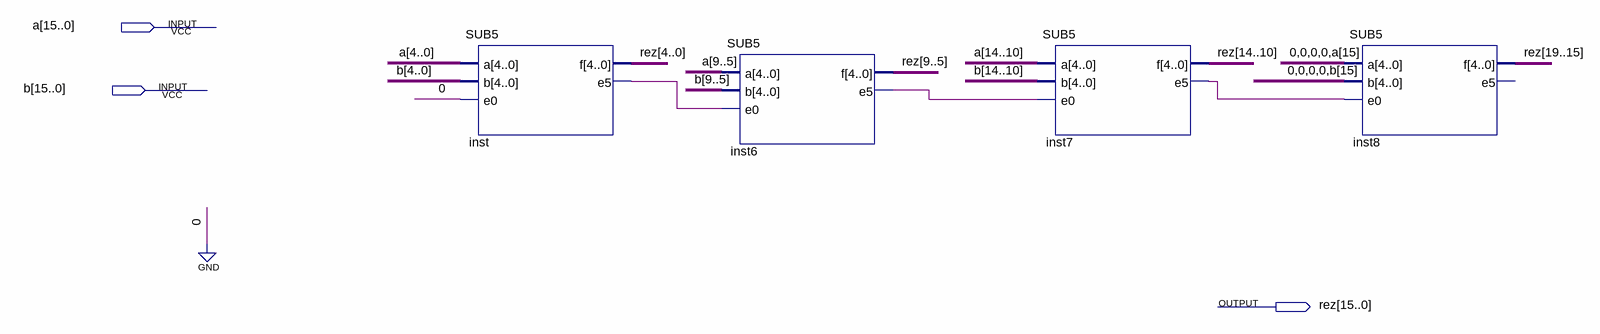
[diagram p0: schematic sheet]
// Quartus schematic sub.bdf as structural Verilog: 4 symbols, 3 pins
module sub (
  input  [15:0] a,
  input  [15:0] b,
  output [19:0] rez
);

  wire inst6_e5, inst7_e5, inst_e5;

  SUB5 inst (.a(a[4:0]), .b(b[4:0]), .e0(1'b0), .f(rez[4:0]), .e5(inst_e5));
  SUB5 inst6 (.a(a[9:5]), .b(b[9:5]), .e0(inst_e5), .f(rez[9:5]), .e5(inst6_e5));
  SUB5 inst7 (.a(a[14:10]), .b(b[14:10]), .e0(inst6_e5), .f(rez[14:10]), .e5(inst7_e5));
  SUB5 inst8 (.a({4'b0000, a[15]}), .b({4'b0000, b[15]}), .e0(inst7_e5), .f(rez[19:15]));  // open: e5
endmodule
